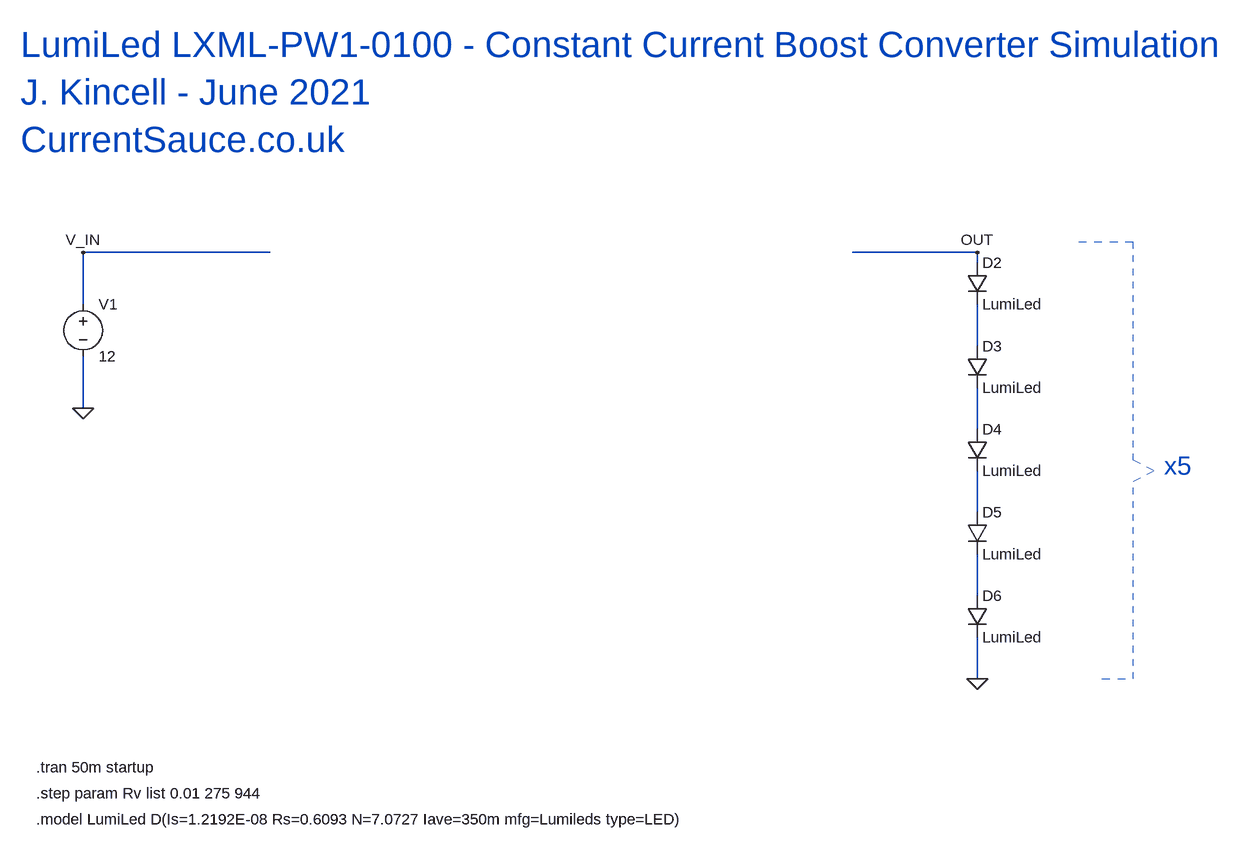
[diagram p0: schematic 1618_lumiled.asc]
1618_lumiled.asc, the LTspice schematic file:
Version 4
SHEET 1 3128 1784
WIRE 1488 896 1200 896
WIRE 2576 896 2384 896
WIRE 2576 912 2576 896
WIRE 1200 976 1200 896
WIRE 2576 1040 2576 976
WIRE 1200 1136 1200 1056
WIRE 2576 1168 2576 1104
WIRE 2576 1296 2576 1232
WIRE 2576 1424 2576 1360
WIRE 2576 1552 2576 1488
FLAG 2576 896 OUT
FLAG 1200 1136 0
FLAG 1200 896 V_IN
FLAG 2576 1552 0
SYMBOL VOLTAGE 1200 960 R0
SYMATTR InstName V1
SYMATTR Value 12
SYMBOL diode 2560 912 R0
SYMATTR InstName D2
SYMATTR Value LumiLed
SYMBOL diode 2560 1040 R0
SYMATTR InstName D3
SYMATTR Value LumiLed
SYMBOL diode 2560 1168 R0
SYMATTR InstName D4
SYMATTR Value LumiLed
SYMBOL diode 2560 1296 R0
SYMATTR InstName D5
SYMATTR Value LumiLed
SYMBOL diode 2560 1424 R0
SYMATTR InstName D6
SYMATTR Value LumiLed
TEXT 1128 1688 Left 2 !.tran 50m startup
TEXT 1128 1728 Left 2 !.step param Rv list 0.01 275 944
TEXT 1128 1768 Left 2 !.model LumiLed D(Is=1.2192E-08 Rs=0.6093 N=7.0727 Iave=350m mfg=Lumileds type=LED)
TEXT 1104 576 Left 5 ;LumiLed LXML-PW1-0100 - Constant Current Boost Converter Simulation\nJ. Kincell - June 2021\nCurrentSauce.co.uk
TEXT 2864 1224 Left 4 ;x5
LINE Normal 2768 880 2720 880 2
LINE Normal 2816 880 2768 880 2
LINE Normal 2816 1216 2816 880 2
LINE Normal 2848 1232 2816 1216 2
LINE Normal 2816 1248 2848 1232 2
LINE Normal 2816 1552 2816 1248 2
LINE Normal 2768 1552 2816 1552 2
LINE Normal 2768 1552 2768 1552 2
LINE Normal 2768 1552 2768 1552 2

The netlist it stands for:
* 1618_lumiled.asc
V1 V_IN 0 12
D2 OUT N001 LumiLed
D3 N001 N002 LumiLed
D4 N002 N003 LumiLed
D5 N003 N004 LumiLed
D6 N004 0 LumiLed
.model D D
.lib standard.dio
.tran 50m startup
.step param Rv list 0.01 275 944
.model LumiLed D(Is=1.2192E-08 Rs=0.6093 N=7.0727 Iave=350m mfg=Lumileds type=LED)
* LumiLed LXML-PW1-0100 - Constant Current Boost Converter Simulation
* J. Kincell - June 2021
* CurrentSauce.co.uk
* x5
.backanno
.end